# EAGLE schematic temp controler full (EAGLE 6.5.0)
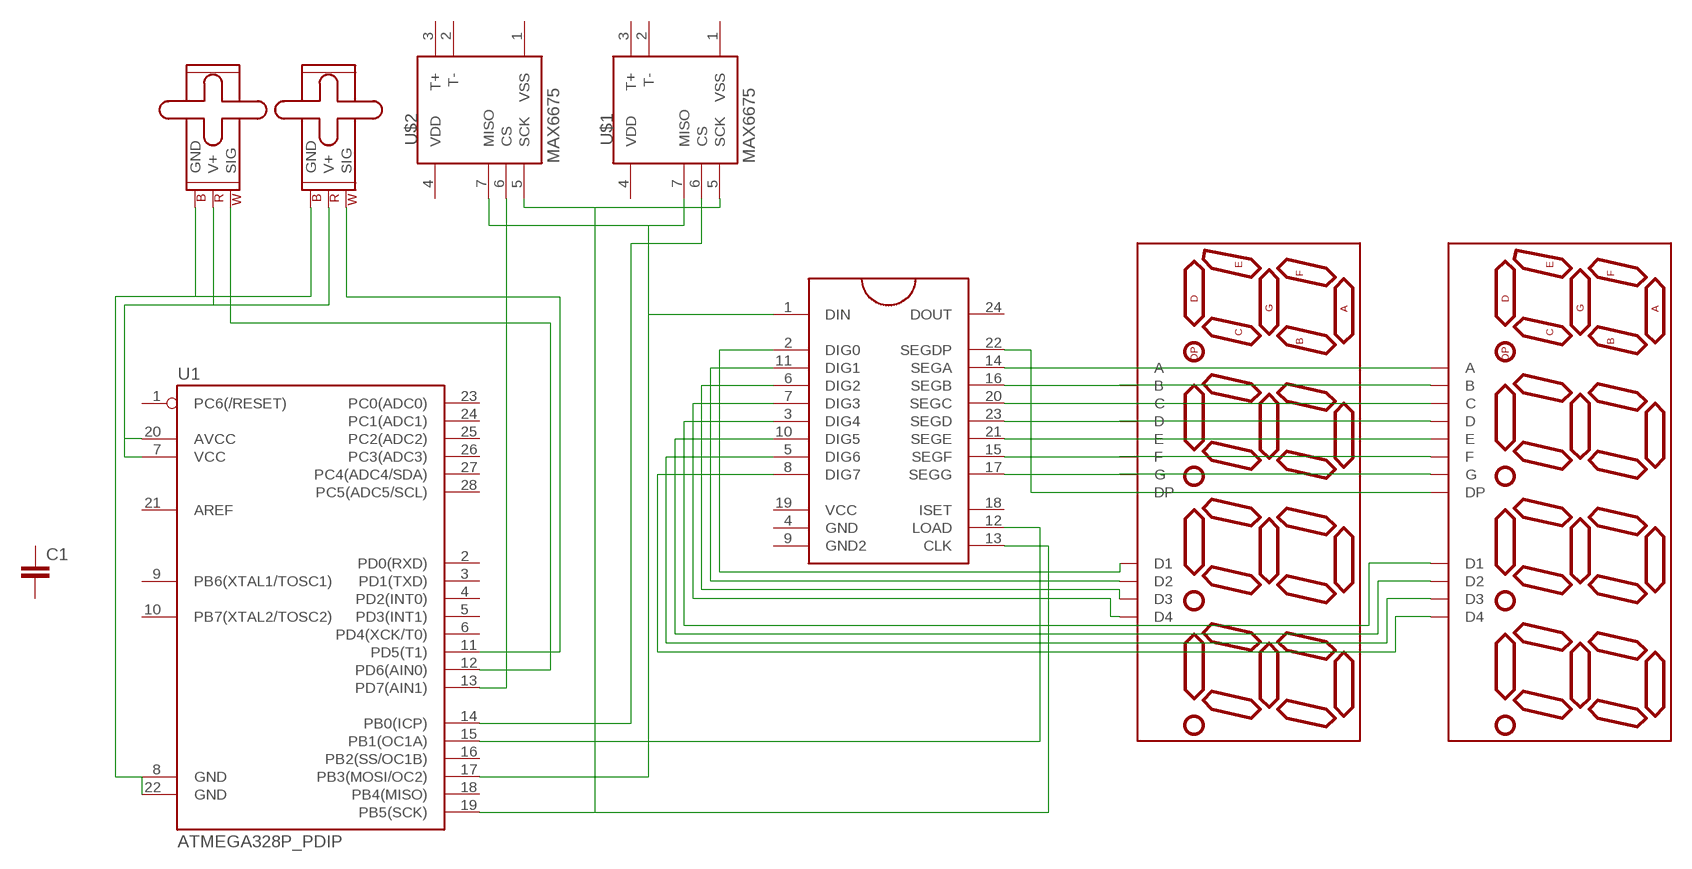
[diagram p0: schematic, sheet 1]

## Parts
C1  0.1UF-50V-20%(PTH)KIT-EZ  [CAP-PTH-SMALL-KIT]
M1  SMALL_SERVO  [1X03]
M2  SMALL_SERVO  [1X03]
U1  ATMEGA328P_PDIP  [DIL28-3]
U$1  MAX6675  [SO08-MAX6675]
U$2  MAX6675  [SO08-MAX6675]
U$3  MAX7219DIP  [DIL24]
U$4  7-SEGMENT-4DIGIT-COUNTERPTH  [7-SEGMENT-4DIGIT-COUNTER]
U$5  7-SEGMENT-4DIGIT-COUNTERPTH  [7-SEGMENT-4DIGIT-COUNTER]

## Nets
N$1: U$3.14(SEGA) U$4.11(A) U$5.11(A)
N$2: U$3.16(SEGB) U$4.7(B) U$5.7(B)
N$3: U$3.20(SEGC) U$4.4(C) U$5.4(C)
N$4: U$3.23(SEGD) U$4.2(D) U$5.2(D)
N$5: U$3.21(SEGE) U$4.1(E) U$5.1(E)
N$6: U$3.15(SEGF) U$4.10(F) U$5.10(F)
N$7: U$3.17(SEGG) U$4.5(G) U$5.5(G)
N$8: U$3.22(SEGDP) U$4.3(DP) U$5.3(DP)
N$9: U$3.2(DIG0) U$4.12(D1)
N$10: U$3.11(DIG1) U$4.9(D2)
N$11: U$3.6(DIG2) U$4.8(D3)
N$12: U$3.7(DIG3) U$4.6(D4)
N$13: M1.2(V+) M2.2(V+) U1.7(VCC) U1.20(AVCC)
N$14: M1.3(GND) M2.3(GND) U1.8(GND) U1.22(GND)
N$15: U$3.3(DIG4) U$5.12(D1)
N$16: U$3.10(DIG5) U$5.9(D2)
N$17: U$3.5(DIG6) U$5.8(D3)
N$18: U$3.8(DIG7) U$5.6(D4)
N$21: U1.17(PB3(MOSI/OC2)) U$1.7(MISO) U$2.7(MISO) U$3.1(DIN)
N$22: U1.19(PB5(SCK)) U$1.5(SCK) U$2.5(SCK) U$3.13(CLK)
N$23: U1.15(PB1(OC1A)) U$3.12(LOAD)
N$24: M2.1(SIG) U1.11(PD5(T1))
N$25: U1.13(PD7(AIN1)) U$2.6(CS)
N$26: U1.14(PB0(ICP)) U$1.6(CS)
N$27: M1.1(SIG) U1.12(PD6(AIN0))
Unconnected: C1.1 C1.2 U1.1(PC6(/RESET)) U1.2(PD0(RXD)) U1.3(PD1(TXD)) U1.4(PD2(INT0)) U1.5(PD3(INT1)) U1.6(PD4(XCK/T0)) U1.9(PB6(XTAL1/TOSC1)) U1.10(PB7(XTAL2/TOSC2)) U1.16(PB2(SS/OC1B)) U1.18(PB4(MISO)) U1.21(AREF) U1.23(PC0(ADC0)) U1.24(PC1(ADC1)) U1.25(PC2(ADC2)) U1.26(PC3(ADC3)) U1.27(PC4(ADC4/SDA)) U1.28(PC5(ADC5/SCL)) U$1.1(VSS) U$1.2(T-) U$1.3(T+) U$1.4(VDD) U$2.1(VSS) U$2.2(T-) U$2.3(T+) U$2.4(VDD) U$3.4(GND) U$3.9(GND2) U$3.18(ISET) U$3.19(VCC) U$3.24(DOUT)

## Library data of the parts
C1 = SparkFun-Capacitors:0.1UF-50V-20%(PTH): CAP-08370; PROD_ID: CAP-08370
M1 M2 = SparkFun-Electromechanical:SMALL_SERVO: Small servo motor This is the small servo used in the SIK. SKU: ROB-09065
U1 = SparkFun-DigitalIC:ATMEGA328P_PDIP: uC used in the Arduino 32kb flash, 1k EEPROM, 2k SRAM This is the through-hole version of this chip.
U$1 U$2 = SparkFun-AnalogIC:MAX6675: K-type thermocouple ADC, SPI output
U$3 = SparkFun-DigitalIC:MAX7219: 8-digit, 8-segment LED display driver, serial input
U$4 U$5 = SparkFun-Displays:7-SEGMENT-4DIGIT-COUNTER